# Altium schematic sheet Smartfin Main PCBA USB.SchDoc
size Letter; TOCFontName: Consolas; TOCFontSize: 24; TOCFontColor: 0; TOCFontAttributes: 0; TOCMaxLinesInTable: 25; TOCVerticalOffset: 200; TOCHorizontalOffset: 500; TOCHorizontalSeparation: 800; TOCVerticalSeparation: 30; TOCHorizTableSize: 640; PageSetup: Record=PageOptions|CenterHorizontal=True|CenterVertical=True|PrintScale=0.96|XCorrection=1.00|YCorrection=1.00|PrintKind=0|BorderSize=5000000|LeftOffset=0|BottomOffset=0|Orientation=2|PaperLength=1000|PaperWidth=1000|Scale=100|PaperSource=7|PrintQuality=-4|MediaType=1|DitherType=10|PaperKind=11" x 17"|PrintScaleMode=1; SheetNumber: 6; SheetTotal: 8
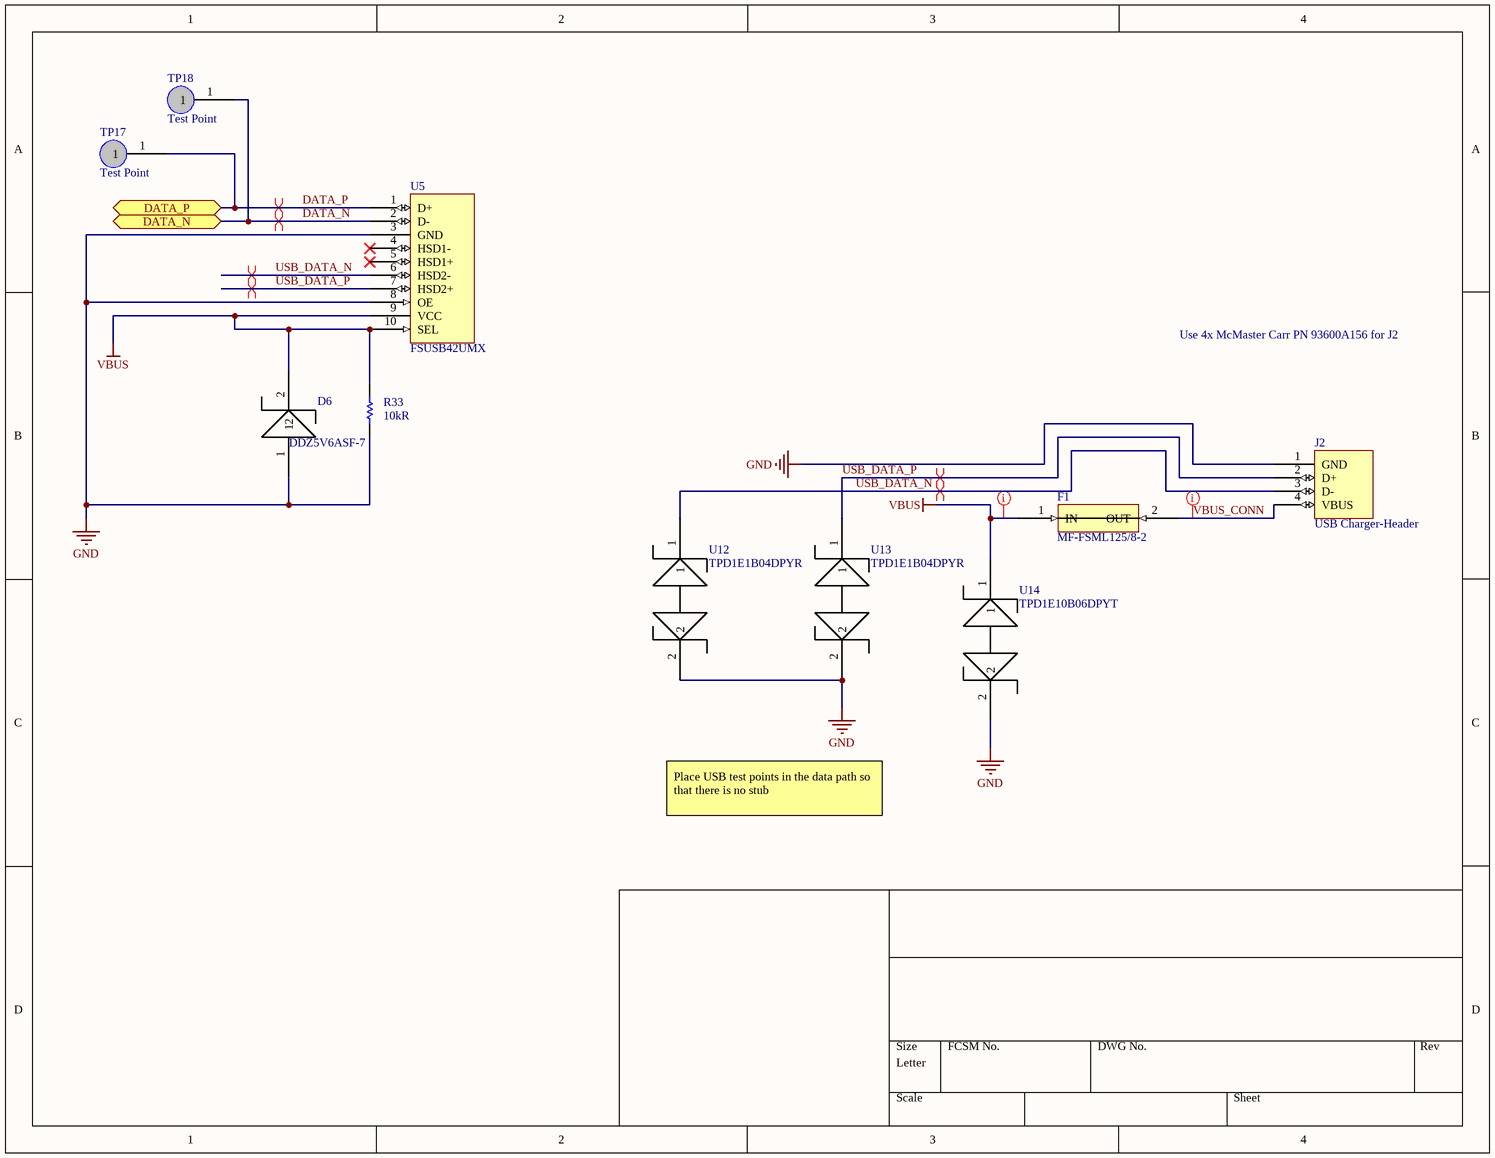
[diagram p0: Smartfin Main PCBA USB.SchDoc]

## Parts
D6  DDZ5V6ASF-7  [SODFL250X75-2N]
F1  MF-FSML125/8-2  [CAF-50P85X165-2N]
J2  USB Charger-Header  [New footprint 1]
R33  value 10kR  [RESC1005X04N]  (hidden comment: RC0402FR-0710KL)
TP17  Test Point  [New footprint 1]
TP18  Test Point  [New footprint 1]
U5  FSUSB42UMX  [IC_FSUSB42UMX]
U12  TPD1E1B04DPYR  [DIO_TPD1E05U06DPYR]
U13  TPD1E1B04DPYR  [DIO_TPD1E05U06DPYR]
U14  TPD1E10B06DPYT  [DIO_TPD1E05U06DPYR]

## Ports
DATA_N (bidir), DATA_P (bidir)

## Nets
GND: D6.1 J2.1(GND) R33.1 U5.3(GND) U5.8(OE) U12.2 U13.2 U14.2
VBUS: D6.2 F1.1(IN) R33.2 U5.9(VCC) U5.10(SEL) U14.1
DATA_N: TP18.1 U5.2(D-) ; port DATA_N
DATA_P: TP17.1 U5.1(D+) ; port DATA_P
USB_DATA_N: J2.3(D-) U5.6(HSD2-) U12.1
USB_DATA_P: J2.2(D+) U5.7(HSD2+) U13.1
VBUS_CONN: F1.2(OUT) J2.4(VBUS)

Not connected (* = marked no-connect by the designer): U5 4(HSD1-)* 5(HSD1+)*

## Layout directives
differential pair: DATA_N, DATA_P, USB_DATA_N, USB_DATA_P
differential pair; rule Signal Stimulus [Kind - Single Pulse    Level - High    Start Time = 0.000    Stop Time = 2.083n    Period Time = 4.167n]: USB_DATA_N, USB_DATA_P
rule Supply Nets [Voltage = 5.000]; net class POWER: VBUS, VBUS_CONN

## Notes on the sheet
- Use 4x McMaster Carr PN 93600A156 for J2
- Place USB test points in the data path so that there is no stub

## Library data of the parts
D6 = CMP-004-000006-2: Zener Diode, 5.42V V(Z), 2.5%, 0.5W, Silicon
F1 = CMP-002-000035-2: Pin Count: 2
J2 = CMP-002-000046-2: Smartfin USB Charger Header
R33 = CMP-002-000053-2: Fixed Resistor, Metal Glaze/thick Film, 0.0625W, 10000ohm, 50V, 1% +/-Tol, 100ppm/Cel, Surface Mount, 0402
TP17 TP18 = CMP-00002-11
U5 = CMP-002-000013-3: USB Switch IC 1 Channel 10-UMLP _1.8x1.4_; MF: ON Semiconductor; Price: None; MP: FSUSB42UMX; Package: UFQFN-10 ON Semiconductor; Source: SnapEDAsch.SchLib; SnapEDA_Link: https://www.snapeda.com/parts/FSUSB42UMX/ON%20Semiconductor/view-part/1672388/?ref=snap; Availability: Unavailable; Design Item ID: FSUSB42UMX; Pin Count: 10; Value: *; Component Type: Standard
U12 U13 = CMP-004-000009-3: 1-channel ESD protection diode with low dynamic resistance and low clamping -Voltage 2-X1SON -40 to 125; MF: Texas Instruments; MP: TPD1E1B04DPYR; Mouser-Purchase-URL: https://snapeda.com/shop?store=Mouser&id=616615; Design Item ID: TPD1E1B04DPYR; Texas_Instruments-Purchase-URL: https://snapeda.com/shop?store=Texas+Instruments&id=616615; Availability: Warning; SnapEDA_Link: https://www.snapeda.com/parts/TPD1E1B04DPYR/Texas%20Instruments/view-part/616615/?ref=snap; Price: None; Component Type: Standard; Package: X1SON-2 Texas Instruments; Pin Count: 2; Value: *; Source: TPD1E1B04DPYR.SchLib
U14 = CMP-004-000000-4: Single-channel ESD in 0402 package with 10pF capacitance and 6-V breakdown 2-X1SON -40 to 125; MF: Texas Instruments; Pin Count: 2; Check_prices: https://www.snapeda.com/parts/TPD1E10B06DPYT/Texas%20Instruments/view-part/231963/?ref=eda; MP: TPD1E10B06DPYT; Design Item ID: TPD1E10B06DPYT; Component Type: Standard; Digi-Key_Part_Number: 296-41842-1-ND; SnapEDA_Link: https://www.snapeda.com/parts/TPD1E10B06DPYT/Texas%20Instruments/view-part/231963/?ref=snap; Package: X1SON-2 Texas Instruments; Purchase-URL: https://pricing.snapeda.com/search/part/TPD1E10B06DPYT/?ref=eda; Source: TPD1E10B06DPYT.SchLib; Value: *